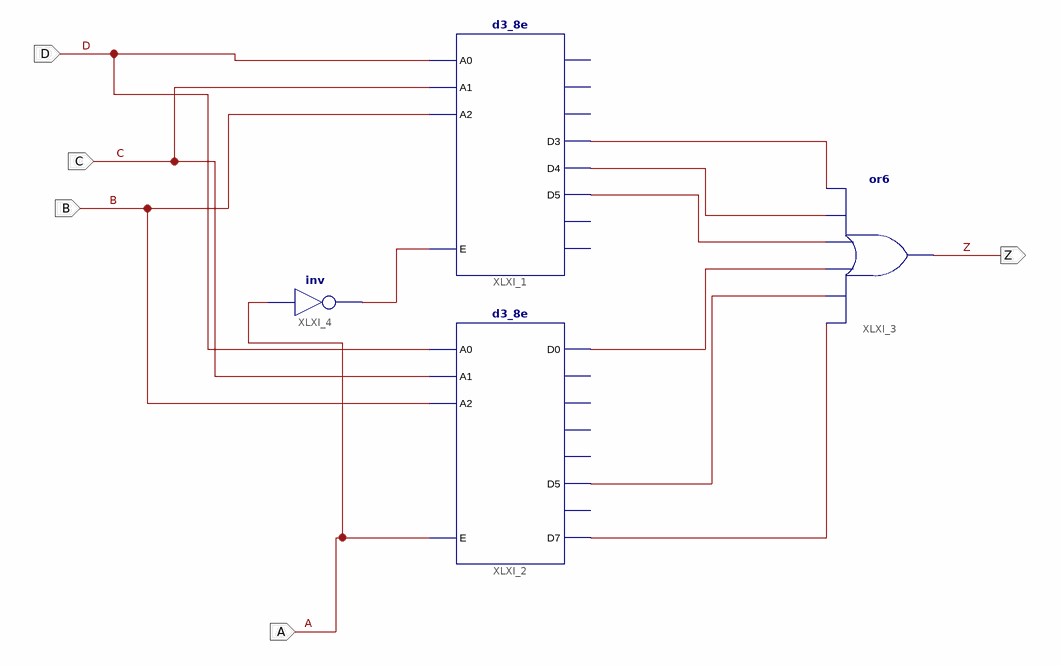
[diagram p0: schematic sheet 1]
// Xilinx ISE schematic p2ej2.sch (artix7) as structural Verilog: 4 symbols, 5 ports
module p2ej2 (
  input  A,
  input  B,
  input  C,
  input  D,
  output Z
);

  wire XLXN_10, XLXN_11, XLXN_12, XLXN_13, XLXN_14, XLXN_15, XLXN_17;

  d3_8e XLXI_1 (
    .A0(D), .A1(C), .A2(B), .E(XLXN_17), .D3(XLXN_10), .D4(XLXN_11), .D5(XLXN_12));  // open: D0, D1, D2, D6, D7
  d3_8e XLXI_2 (.A0(D), .A1(C), .A2(B), .E(A), .D0(XLXN_13), .D5(XLXN_15), .D7(XLXN_14));  // open: D1, D2, D3, D4, D6
  or XLXI_3 (Z, XLXN_14, XLXN_15, XLXN_13, XLXN_12, XLXN_11, XLXN_10);
  not XLXI_4 (XLXN_17, A);
endmodule
